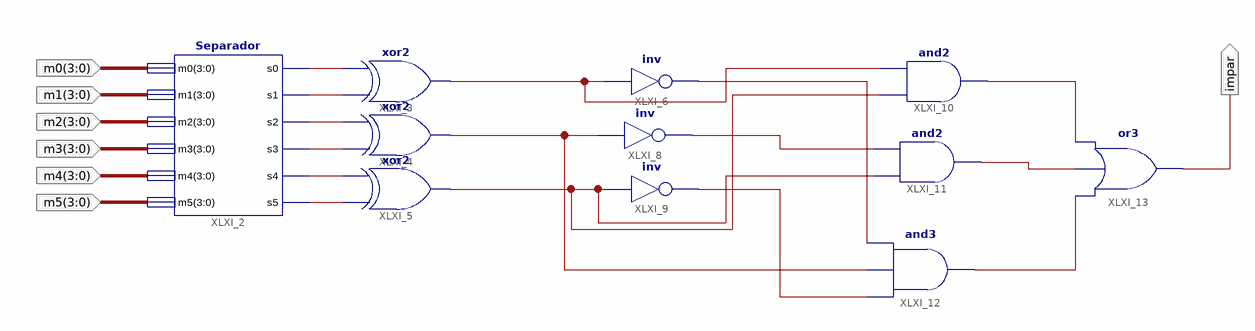
[diagram p0: schematic sheet 1]
// Xilinx ISE schematic Somador.sch (spartan6) as structural Verilog: 11 symbols, 7 ports
module Somador (
  input  [3:0] m0,
  input  [3:0] m1,
  input  [3:0] m2,
  input  [3:0] m3,
  input  [3:0] m4,
  input  [3:0] m5,
  output impar
);

  wire XLXN_1, XLXN_2, XLXN_3, XLXN_4, XLXN_5, XLXN_6, XLXN_14, XLXN_16, XLXN_17, XLXN_18, XLXN_19, XLXN_20,
       XLXN_21, XLXN_22, XLXN_23;

  Separador XLXI_2 (
    .m0(m0), .m1(m1), .m2(m2), .m3(m3), .m4(m4), .m5(m5), .s0(XLXN_1), .s1(XLXN_2), .s2(XLXN_3), .s3(XLXN_4),
    .s4(XLXN_5), .s5(XLXN_6));
  xor XLXI_3 (XLXN_14, XLXN_2, XLXN_1);
  xor XLXI_4 (XLXN_19, XLXN_4, XLXN_3);
  xor XLXI_5 (XLXN_16, XLXN_6, XLXN_5);
  not XLXI_6 (XLXN_18, XLXN_14);
  not XLXI_8 (XLXN_17, XLXN_19);
  not XLXI_9 (XLXN_20, XLXN_16);
  and XLXI_10 (XLXN_21, XLXN_16, XLXN_14);
  and XLXI_11 (XLXN_22, XLXN_16, XLXN_17);
  and XLXI_12 (XLXN_23, XLXN_20, XLXN_19, XLXN_18);
  or XLXI_13 (impar, XLXN_23, XLXN_22, XLXN_21);
endmodule
